# EAGLE design cluster2 (EAGLE 9.4.2)
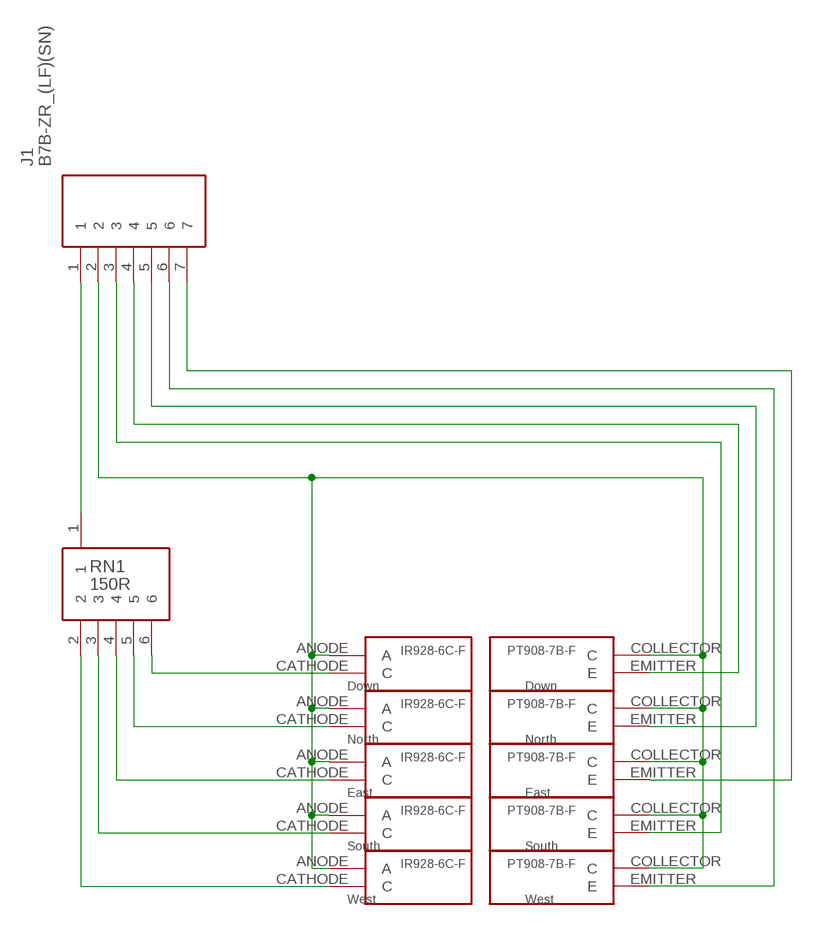
[diagram p0: schematic, sheet 1]

## Parts
J1  B7B-ZR_(LF)(SN)  [SHDR7W50P0X150_1X7_1200X350X45]
LED1  Down  IR928-6C-F  [IR928-6C-F]
LED2  North  IR928-6C-F  [IR928-6C-F]
LED3  East  IR928-6C-F  [IR928-6C-F]
LED4  South  IR928-6C-F  [IR928-6C-F]
LED5  West  IR928-6C-F  [IR928-6C-F]
PT1  Down  PT908-7B-F  [PT908-7B-F]
PT2  North  PT908-7B-F  [PT908-7B-F]
PT3  East  PT908-7B-F  [PT908-7B-F]
PT4  South  PT908-7B-F  [PT908-7B-F]
PT5  West  PT908-7B-F  [PT908-7B-F]
RN1  150R  6PIN-RESISTOR-NETWORK6PIN-RESISTOR-NETWORK  [6PIN-RESISTOR-NETWORK]

## Nets
N$1: J1.1 RN1.1
N$2: LED5.CATHODE(C) RN1.2
N$3: LED4.CATHODE(C) RN1.3
N$4: LED3.CATHODE(C) RN1.4
N$5: LED2.CATHODE(C) RN1.5
N$6: LED1.CATHODE(C) RN1.6
N$7: J1.2 LED1.ANODE(A) LED2.ANODE(A) LED3.ANODE(A) LED4.ANODE(A) LED5.ANODE(A) PT1.COLLECTOR(C) PT2.COLLECTOR(C) PT3.COLLECTOR(C) PT4.COLLECTOR(C) PT5.COLLECTOR(C)
N$8: J1.3 PT4.EMITTER(E)
N$9: J1.7 PT3.EMITTER(E)
N$10: J1.5 PT2.EMITTER(E)
N$11: J1.4 PT1.EMITTER(E)
N$12: J1.6 PT5.EMITTER(E)

## Library data of the parts
J1 = SamacSys_Parts:B7B-ZR_(LF)(SN): Connector,Multipole,PCB use,B7B-ZR (LF)( JST ZH Series, 1.5mm Pitch 7 Way 1 Row Straight PCB Header, Solder Termination, 1A Source: Datasheet <http://docs-emea.rs-online.com/webdocs/1147/0900766b81147f94.pdf>; DESCRIPTION: Connector,Multipole,PCB use,B7B-ZR (LF)( JST ZH Series, 1.5mm Pitch 7 Way 1 Row Straight PCB Header, Solder Termination, 1A; HEIGHT: 4.5mm; MANUFACTURER_NAME: JST (JAPAN SOLDERLESS TERMINALS); MANUFACTURER_PART_NUMBER: B7B-ZR (LF)(SN); RS_PART_NUMBER: 7620828; RS_PRICE-STOCK: https://uk.rs-online.com/web/p/products/7620828
LED1-LED5 = IR928-6C-F:IR928-6C-F
PT1-PT5 = PT908-7B-F:PT908-7B-F
RN1 = 6 pin resistor network:6PIN-RESISTOR-NETWORK: 6 pin, standard resistor network; HEIGHT: mm

## Board
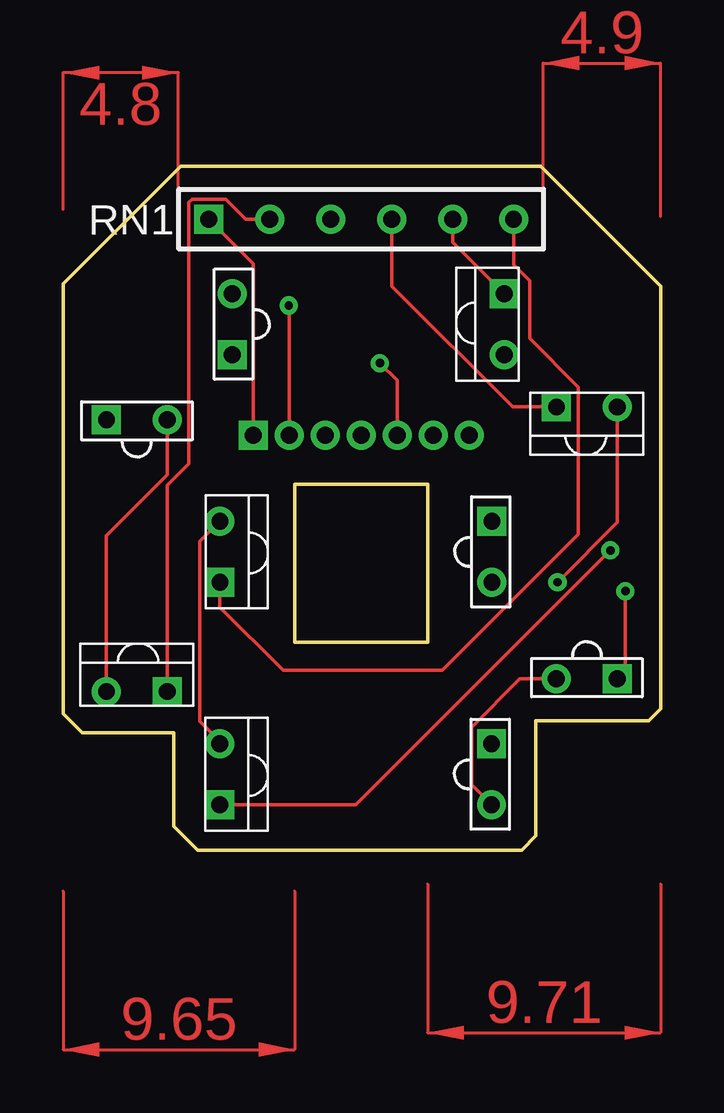
[diagram p1: board, top side]
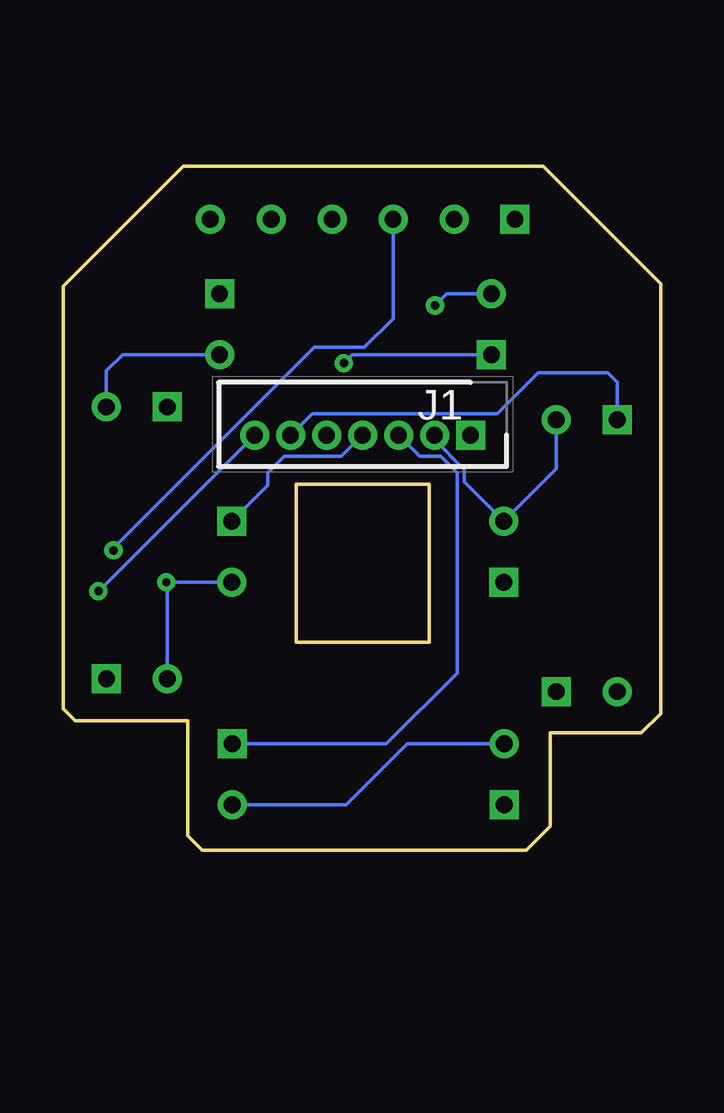
[diagram p2: board, bottom side, seen from below]

Size 24.9 x 28.5 mm. Coordinates in mm from the lower left corner, seen from the top.
Outline: 9.65,15.25 15.19,15.25 15.19,8.67 9.65,8.67 9.65,15.25
Outline: 5.6,0 19.1,0 19.7,0.6 19.7,5.4 24.4,5.4 24.9,5.9 24.9,23.5 19.9,28.5 4.9,28.5 0,23.6 0,5.7 0.8,4.9 4.6,4.9 4.6,1 5.6,0
Copper layers (1*16): Top 0.035mm / dielectric 1.5mm / Bottom 0.035mm
Design rules "default": minimum track width 6mil, minimum drill 0.35mm, track to track 6mil, track to pad 6mil, pad to pad 6mil, via to via 6mil, smd to smd 6mil, copper to edge 40mil, drill to drill 6mil, minimum pad ring 10mil, minimum via ring 8mil, stop-mask expansion 4mil, vias tented up to drill 0mil, thermal gap 10mil

### Footprints (pad centres in the part's own frame; a part is rotated, then mirrored left to right if it is on the bottom)
SHDR7W50P0X150_1X7_1200X350X45 = drill 0.7 pad 1.1 square: 1 0,0 | drill 0.7 pad 1.1: 2 1.5,0; 3 3,0; 4 4.5,0; 5 6,0; 6 7.5,0; 7 9,0
IR928-6C-F = drill 0.7: ANODE 1.27,0 | drill 0.7 square: CATHODE -1.27,0
PT908-7B-F = drill 0.7: COLLECTOR 1.27,0 | drill 0.7 square: EMITTER -1.27,0
6PIN-RESISTOR-NETWORK = drill 0.7 square: 1 0,0 | drill 0.7: 2 2.54,0; 3 5.08,0; 4 7.62,0; 5 10.16,0; 6 12.7,0

### Placement (x,y rotation side)
J1  7.92,17.3 180 bottom
LED1  6.53,12.44 90 top
LED2  18.38,21.92 270 top
LED3  21.82,18.47 0 top
LED4  6.52,3.17 90 top
LED5  3.07,6.62 180 top
PT1  17.87,12.44 270 top
PT2  7.05,21.92 90 top
PT3  21.82,7.14 180 top
PT4  17.85,3.17 270 top
PT5  3.07,17.95 0 top
RN1  6.07,26.3 0 top

### Tracks (layer width: path | path; a pad name or v marks a point on that pad's centre or on a via)
N$1
  Top 0.152: RN1.1 7.92,24.45 J1.1
N$2
  Top 0.152: RN1.2 7.6,26.3 6.77,27.13 5.37,27.13 5.24,27 5.24,16.11 4.34,15.21 LED5.CATHODE
N$3  (via drill 0.35)
  Top 0.152: LED4.CATHODE 12.2,1.9 v22.8,12.5
  Bottom 0.152: RN1.3 11.15,22.15 12.34,20.96 14.44,20.96 22.8,12.6 v22.8,12.5
N$4
  Top 0.152: LED3.CATHODE 18.73,18.47 13.69,23.51 RN1.4
N$5
  Top 0.152: LED2.CATHODE 16.23,25.34 RN1.5
N$6
  Top 0.152: LED1.CATHODE 6.53,10.13 9.16,7.5 15.8,7.5 21.46,13.16 21.46,19.3 19.43,21.33 19.43,23.73 18.77,24.4 RN1.6
N$7  (via drill 0.35)
  Top 0.152: LED5.ANODE 1.8,13.1 4.34,15.64 PT5.COLLECTOR | LED1.ANODE 5.7,12.88 5.7,5.37 6.52,4.55 LED4.ANODE | PT4.COLLECTOR 17.02,2.74 17.02,5.14 19.02,7.14 PT3.COLLECTOR | v9.4,22.7 9.42,22.68 J1.2 | LED3.ANODE 23.09,13.66 v20.6,11.17
  Bottom 0.152: LED3.ANODE 23.09,19.97 22.42,20.65 LED2.ANODE | PT4.COLLECTOR 13.1,1.9 10.56,4.44 LED4.ANODE | PT1.COLLECTOR v20.6,11.17 20.55,11.12 PT3.COLLECTOR | PT2.COLLECTOR 8.91,23.19 v9.4,22.7 | PT5.COLLECTOR 4.34,15.9 LED1.ANODE 8.18,15.35 8.18,15.86 9.42,17.1 J1.2
N$8
  Bottom 0.152: PT4.EMITTER 11.43,4.44 8.48,7.38 8.48,15.73 9.16,16.42 10.03,16.42 J1.3
N$9  (via drill 0.35)
  Top 0.152: v23.43,10.8 23.43,7.48 PT3.EMITTER
  Bottom 0.152: J1.7 v23.42,10.8 v23.43,10.8
N$10  (via drill 0.35)
  Top 0.152: v13.2,20.3 13.92,19.58 J1.5
  Bottom 0.152: PT2.EMITTER 12.85,20.65 v13.2,20.3
N$11
  Bottom 0.152: J1.4 13.3,16.42 15.68,16.42 16.36,15.73 16.36,15.22 PT1.EMITTER
N$12
  Bottom 0.152: PT5.EMITTER 1.8,19.5 2.2,19.9 5.1,19.9 6.8,18.2 14.52,18.2 J1.6
(copper drawn outside any net)
  shapes: Top area x4